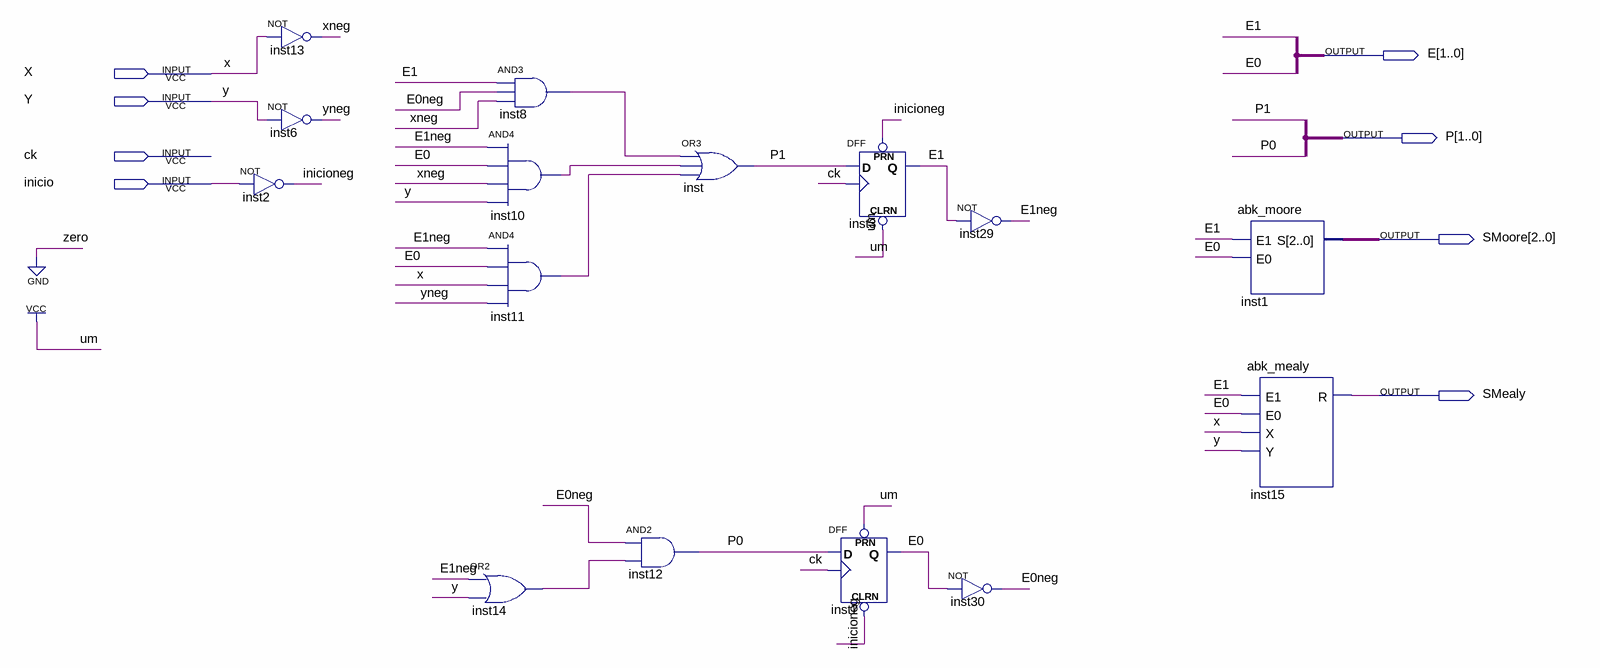
[diagram p0: schematic sheet]
// Quartus schematic abk_maquina.bdf as structural Verilog: 15 symbols, 8 pins
module abk_maquina (
  input  X,
  input  Y,
  input  ck,
  input  inicio,
  output [1:0] E,
  output [1:0] P,
  output [2:0] SMoore,
  output SMealy
);

  wire E0neg, E1neg, inicioneg, inst8_out, inst10_out, inst11_out, inst14_out, xneg, yneg;

  not inst2 (inicioneg, inicio);
  not inst13 (xneg, X);
  not inst6 (yneg, Y);
  and inst8 (inst8_out, E[1], E0neg, xneg);
  and inst10 (inst10_out, E1neg, E[0], xneg, Y);
  and inst11 (inst11_out, E1neg, E[0], X, yneg);
  or inst14 (inst14_out, E1neg, Y);
  or inst (P[1], inst8_out, inst10_out, inst11_out);
  and inst12 (P[0], E0neg, inst14_out);
  DFF inst7 (.CLRN(inicioneg), .CLK(ck), .D(P[0]), .PRN(1'b1), .Q(E[0]));
  DFF inst3 (.CLRN(1'b1), .CLK(ck), .D(P[1]), .PRN(inicioneg), .Q(E[1]));
  not inst29 (E1neg, E[1]);
  not inst30 (E0neg, E[0]);
  abk_moore inst1 (.E1(E[1]), .E0(E[0]), .S(SMoore));
  abk_mealy inst15 (.E1(E[1]), .E0(E[0]), .X(X), .Y(Y), .R(SMealy));
endmodule
